# EAGLE design Walkie-Textie (EAGLE 7.6.0)
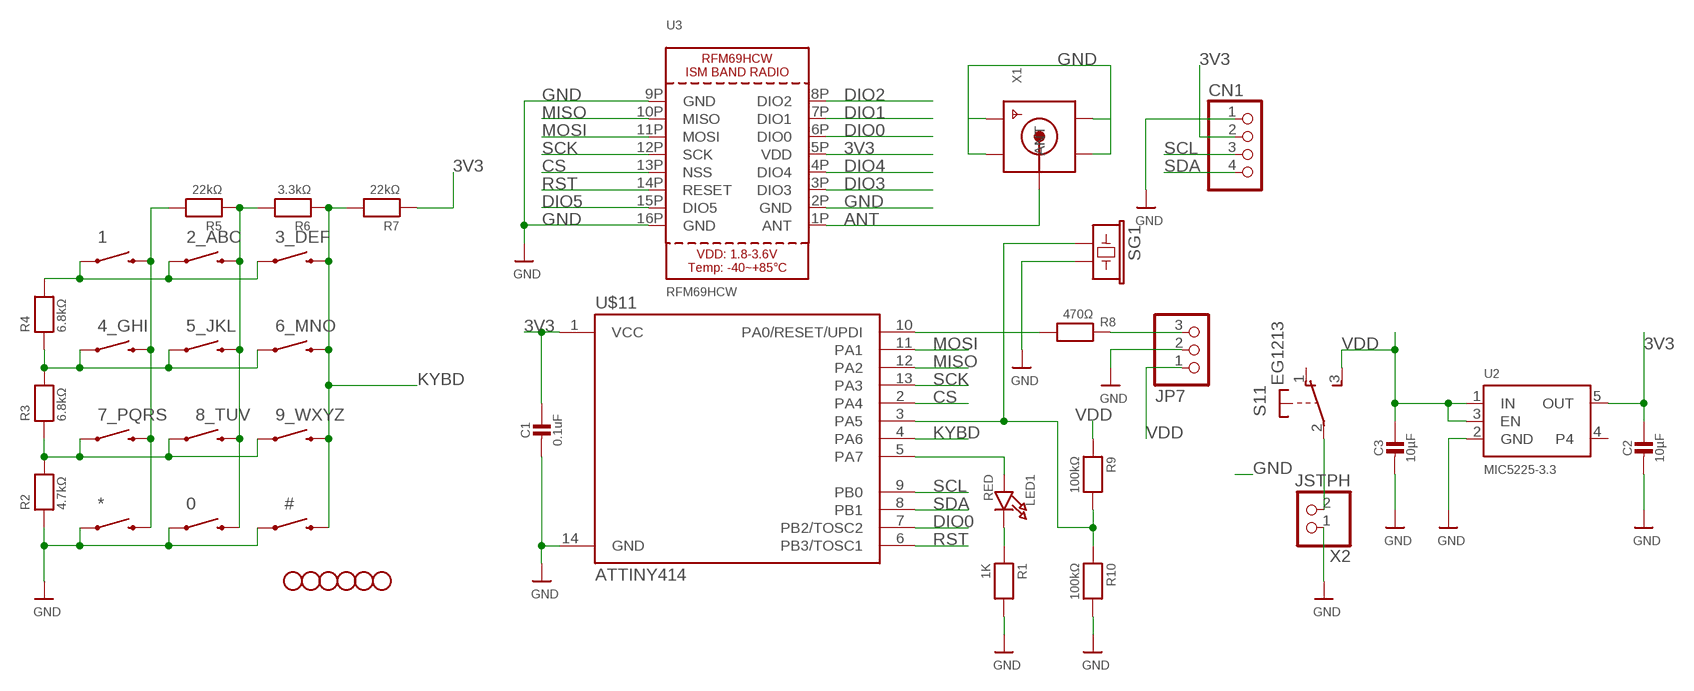
[diagram p0: schematic, sheet 1]

## Parts
0  SWITCH-MOMENTARY-2SMD-4  [TACTILE_SWITCH_TALL]
1  SWITCH-MOMENTARY-2SMD-4  [TACTILE_SWITCH_TALL]
2_ABC  SWITCH-MOMENTARY-2SMD-4  [TACTILE_SWITCH_TALL]
3_DEF  SWITCH-MOMENTARY-2SMD-4  [TACTILE_SWITCH_TALL]
4_GHI  SWITCH-MOMENTARY-2SMD-4  [TACTILE_SWITCH_TALL]
5_JKL  SWITCH-MOMENTARY-2SMD-4  [TACTILE_SWITCH_TALL]
6_MNO  SWITCH-MOMENTARY-2SMD-4  [TACTILE_SWITCH_TALL]
7_PQRS  SWITCH-MOMENTARY-2SMD-4  [TACTILE_SWITCH_TALL]
8_TUV  SWITCH-MOMENTARY-2SMD-4  [TACTILE_SWITCH_TALL]
9_WXYZ  SWITCH-MOMENTARY-2SMD-4  [TACTILE_SWITCH_TALL]
#  SWITCH-MOMENTARY-2SMD-4  [TACTILE_SWITCH_TALL]
*  SWITCH-MOMENTARY-2SMD-4  [TACTILE_SWITCH_TALL]
C1  0.1uF  CAP_CERAMIC0805-NOOUTLINE  [0805-NO]
C2  10µF  CAP_CERAMIC0805-NOOUTLINE  [0805-NO]
C3  10µF  CAP_CERAMIC0805-NOOUTLINE  [0805-NO]
CN1  HEADER-1X4ROUND  [1X04_ROUND]
JP1  STAND-OFF  [STAND-OFF]
JP2  STAND-OFF  [STAND-OFF]
JP3  STAND-OFF  [STAND-OFF]
JP4  STAND-OFF  [STAND-OFF]
JP5  STAND-OFF  [STAND-OFF]
JP6  STAND-OFF  [STAND-OFF]
JP7  PINHD-1X3CB  [1X03-CLEANBIG]
LED1  RED  LED0805_NOOUTLINE  [CHIPLED_0805_NOOUTLINE]
R1  1K  RESISTOR_0805MP  [_0805MP]
R2  4.7kΩ  RESISTOR_0805MP  [_0805MP]
R3  6.8kΩ  RESISTOR_0805MP  [_0805MP]
R4  6.8kΩ  RESISTOR_0805MP  [_0805MP]
R5  22kΩ  RESISTOR_0805MP  [_0805MP]
R6  3.3kΩ  RESISTOR_0805MP  [_0805MP]
R7  22kΩ  RESISTOR_0805MP  [_0805MP]
R8  470Ω  RESISTOR_0805MP  [_0805MP]
R9  100kΩ  RESISTOR_0805MP  [_0805MP]
R10  100kΩ  RESISTOR_0805MP  [_0805MP]
S1  EG1213  [EG1213]
SG1  BUZZERSMD3  [BUZZER-CMT1102]
U2  MIC5225-3.3  VREG_SOT23-5  [SOT23-5]
U3  RFM69HCW  RFM69HCW_SMT  [RFMHCW_SMT]
U$11  ATTINY414  [SO14]
X1  SMACONNECTOR_EDGE  [SMA_EDGELAUNCH]
X2  JSTPH  CON_JST_PH_2PIN  [JSTPH2]

## Nets
3V3 [power]: C1.1 C2.1 CN1.2 R7.1 U2.5(OUT) U3.5P(VDD) U$11.1(VCC)
ANT: U3.1P(ANT) X1.P(ANT)
CS: U3.13P(NSS) U$11.2(PA4)
DIO0: U3.6P(DIO0) U$11.7(PB2/TOSC2)
DIO1: U3.7P(DIO1)
DIO2: U3.8P(DIO2)
DIO3: U3.3P(DIO3)
DIO4: U3.4P(DIO4)
DIO5: U3.15P(DIO5)
GND: 0.A2 #.A2 *.A2 C1.2 C2.2 C3.2 CN1.1 JP7.2 R1.2 R2.1 R10.2 SG1.2 U2.2(GND) U3.2P(GND) U3.9P(GND) U3.16P(GND) U$11.14(GND) X1.GND@1(GND4) X1.GND@2(GND3) X1.GND@3(GND2) X1.GND@4(GND1) X2.1
GND1: 1.A2 2_ABC.A2 3_DEF.A2 R4.2
KYBD: 3_DEF.B2 6_MNO.B2 9_WXYZ.B2 #.B2 R6.1 R7.2 U$11.4(PA6)
MISO: U3.10P(MISO) U$11.12(PA2)
MOSI: U3.11P(MOSI) U$11.11(PA1)
N$1: R8.2 U$11.10(PA0/RESET/UPDI)
N$2: LED1.A U$11.5(PA7)
N$3: JP7.3 R8.1
N$6: 4_GHI.A2 5_JKL.A2 6_MNO.A2 R3.2 R4.1
N$7: 7_PQRS.A2 8_TUV.A2 9_WXYZ.A2 R2.2 R3.1
N$9: R9.2 R10.1 SG1.1 U$11.3(PA5)
N$11: 1.B2 4_GHI.B2 7_PQRS.B2 *.B2 R5.2
N$12: 0.B2 2_ABC.B2 5_JKL.B2 8_TUV.B2 R5.1 R6.2
N$16: LED1.C R1.1
N$17: S1.2(1:P) X2.2
RST: U3.14P(RESET) U$11.6(PB3/TOSC1)
SCK: U3.12P(SCK) U$11.13(PA3)
SCL: CN1.3 U$11.9(PB0)
SDA: CN1.4 U$11.8(PB1)
VDD: C3.1 JP7.1 R9.1 S1.3(1:S) U2.1(IN) U2.3(EN)
Unconnected: S1.1(1:O) S1.MT1(MT) S1.MT2(MT) U2.4

## Library data of the parts
0 1 2_ABC 3_DEF 4_GHI 5_JKL 6_MNO 7_PQRS 8_TUV 9_WXYZ # * = SparkFun-Electromechanical:SWITCH-MOMENTARY-2: Various NO switches- pushbuttons, reed, etc; PROD_ID: SWCH-11966
C1-C3 = microbuilder:CAP_CERAMIC: Ceramic Capacitors For new designs, use the packages preceded by an '_' character since they are more reliable: The following footprints should be used on most boards: _0402 - Standard footprint for regular board layouts _0603 - Standard footprint for regular board layouts _0805 - Standard footprint for regular board layouts _1206 - Standard footprint for regular board layouts For extremely tight-pitch boards where space is at a premium, the following 'micro-pitch' footprints can be used (smaller pads, no silkscreen outline, etc.): _0402MP - Micro-pitch footprint for very dense/compact boards _0603MP - Micro-pitch footprint for very dense/compact boards _0805MP - Micro-pitch footprint for very dense/compact boards _1206MP - Micro-pitch footprint for very dense/compact boards
CN1 = technoblogy:HEADER-1X4: PIN HEADER
JP1-JP6 = SparkFun:STAND-OFF: Stand Off This is the mechanical footprint for a #4 phillips button head screw. Use the keepout ring to avoid running the screw head into surrounding components. SKU : PRT-00447
JP7 = adafruit:PINHD-1X3: PIN HEADER
LED1 = microbuilder:LED: LED 0603 - 0603 Surface Mount Package 2mA: Green LED - Low Power (3.9mcd, 2ma, 1.7Vf) - Digikey: 475-2709-2-ND Orange LED - Low Power (9.8mcd, 2ma, 1.8Vf) - Digikey: 475-1194-2-ND Red LED - Low Power (5mcd, 2ma, 1.8Vf) - Digikey: 475-1195-2-ND Yellow LED - Low Power (7mcd, 2ma, 1.8Vf) - Digikey: 475-1196-2-ND 5mA: Blue LED - Low Power (17mcd, 5ma, 2.9Vf) - Digikey: LNJ937W8CRACT-ND 0805 - 0805 Surface Mount Package 2mA: Red LED (8.8mcd, 2mA, 1.8Vf, Clear) - Low Power [Digikey: 475-2510-1-ND] Green LED (5mcd, 2mA, 1.8Vf, Clear) - Low Power [Digikey: 475-2730-1-ND] Yellow LED (11.3mcd, 2mA, 1.8Vf, Clear) - Low Power [Digikey: 475-2555-1-ND] 20mA: Red LED (104mcd, 20mA, Diffused) - LS R976 [Digikey: 475-1278-6-ND] Red LED (12mcd, 20mA, 2.0Vf, Clear) - APT2012EC [Digikey: 754-1128-1-ND] Green LED (15mcd, 20mA, 2.2Vf, Clear) - APT2012GC [Digikey: 754-1131-1-ND] Orange LED (160mcd, 20mA, 2.1Vf, Clear) - APT2012SECK [Digikey: 754-1130-1-ND] 1206 - 1206 Surface Mount Package Green LED (26mcd, 20mA, Diffused) - LG N971 [Digikey: 475-1407-6-ND] Red LED (15mcd, 20mA, Diffused) - LH N974 [Digikey: 475-1416-6-ND]
R1-R10 = microbuilder:RESISTOR: Resistors 0402 - 0402 Surface Mount Package 22 Ohm 1% 1/16W [Digikey: 311-22.0LRTR-ND] 33 Ohm 5% 1/16W 1.0K 5% 1/16W 1.5K 5% 1/16W 2.0K 1% 1/16W 10.0K 1% 1/16W [Digikey: 311-10.0KLRTR-ND] 10.0K 5% 1/16W [Digikey: RMCF0402JT10K0TR-ND] 12.1K 1% 1/16W [Digikey: 311-22.0LRTR-ND] 100.0K 5% 1/16W 0603 - 0603 Surface Mount Package 0 Ohm 1/10 Watt 1% Resistor 15 Ohm 1/10 Watt 1% Resistor 33 Ohm 1/10 Watt 1% Resistor 49.9 Ohm 1/10 Watt 1% Resistor 100 Ohm 1/10 Watt 1% Resistor 150 Ohm 1/10 Watt 1% Resistor 240 Ohm 1/10 Watt 1% Resistor 390 Ohm 1/10 Watt 1% Resistor 560 Ohm 1/10 Watt 1% Resistor 680 Ohm 1/10 Watt 1% Resistor 750 Ohm 1/10 Watt 1% Resistor 1.0K Ohm 1/10 Watt 1% Resistor 1.5K Ohm 1/10 Watt 1% Resistor 2.0K Ohm 1/10 Watt 1% Resistor 2.2K Ohm 1/10 Watt 1% Resistor 3.3K Ohm 1/10 Watt 1% Resistor 4.7K Ohm 1/10 Watt 1% Resistor 10.0K Ohm 1/10 Watt 1% Resistor 12.0K Ohm 1/10 Watt 1% Resistor 12.1K Ohm 1/10 Watt 1% Resistor 20.0K Ohm 1/10 Watt 1% Resistor 33.0K Ohm 1/10 Watt 1% Resistor 100.0K Ohm 1/10 Watt 1% Resistor 0805 - 0805 Surface Mount Package 0 Ohm 1/8 Watt 1% Resistor 33 Ohm 1/8 Watt 1% Resistor 100 Ohm 1/8 Watt 1% Resistor 150 Ohm 1/8 Watt 1% Resistor 200 Ohm 1/8 Watt 1% Resistor 240 Ohm 1/8 Watt 1% Resistor 330 Ohm 1/8 Watt 1% Resistor 390 Ohm 1/8 Watt 1% Resistor 470 Ohm 1/8 Watt 1% Resistor 1.0K Ohm 1/8 Watt 1% Resistor 1.5K Ohm 1/8 Watt 1% Resistor 2.0K Ohm 1/8 Watt 1% Resistor 4.7K Ohm 1/8 Watt 1% Resistor 5.1K Ohm 1/8 Watt 1% Resistor 5.6K Ohm 1/8 Watt 1% Resistor 10.0K Ohm 1/8 Watt 1% Resistor 22.0K Ohm 1/8 Watt 1% Resistor 33.0K Ohm 1/8 Watt 1% Resistor 100K Ohm 1/8 Watt 1% Resistor 1206 - 1206 Surface Mount Package 2012 - 2010 Surface Mount Package 0.11 Ohm 1/2 Watt 1% Resistor - Digikey: RHM.11UCT-ND
S1 = adafruit:EG1213: E-Switch right-angle slide SPDT Part #EG1213 http://www.ladyada.net/library/eagle
SG1 = SparkFun-Electromechanical:BUZZER: Buzzer 12mm Spark Fun Electronics SKU : Comp-Buzzer
U2 = microbuilder:VREG_SOT23-5: SOT23-5 Fixed Voltage Regulators Part Current Out V Out V In V Dropout θJA (°C/W) TJ (°C) Digikey Part No. ADP121 150mA 3.3V 3.4-5.5V 0.09V @ 150mA -- -- ADP121-AUJZ33R7CT-ND ADP121 150mA 3.0V 3.1-5.5V 0.09V @ 150mA -- -- ADP121-AUJZ30R7CT-ND ADP122 300mA 3.3V 3.4-5.5V 0.085V @ 300mA -- -- ADP122AUJZ-3.3-R7CT-ND ADP1712 300mA 3.3V 3.5-5.5V 0.17V @ 300mA -- -- ADP1712AUJZ-3.3-R7TR-ND AP7311 (Low Cost) 150mA 3.3V 3.5-6V 0.15V @ 150mA -- -- AP7311-33WG-7DICT-ND LD39015M18R 150mA 1.8V 1.9V-5.5V 0.08V @ 100mA -- -- 497-6977-1-ND LP2985A-33DBVR 150mA 3.3V 3.3-16V 0.28V @ 150mA 206 150 296-18479-1-ND MCP1824T-3302E/OT 300mA 3.3V 3.5V-6V 0.2V @ 300mA -- -- MCP1824T-3302E/OTCT-ND MIC5205-2.5YM5 TR 150mA 2.5V 2.7-16V 0.165V @ 150mA -- -- 576-1257-2-ND MIC5205-3.0YM5 TR 150mA 3.0V 3.2V-16V 0.165V @ 150mA -- -- 576-1258-2-ND MIC5205-3.3YM5 TR 150mA 3.3V 3.5V-16V 0.165V @ 150mA -- -- 576-1259-2-ND TPS780330220 150mA 3.3V+2.2V 3.6-5.5V 250mV Max -- -- 296-23332-1-ND TDA3663/N1,135 100mA 3.3V 3.5-45V 0.18V @ 50mA -- -- 568-5343-1-ND Max operating temp can be calculated using θJA, TJ (max junction temperature), and power in watts. Set the "Maximum Ambient Temperature" until it reaches TJ ("Max Junction Temperature"), which is the absolute limit for safe use of the regulator: Heat Sink Temperature Calculator <http://www.daycounter.com/Calculators/Heat-Sink-Temperature-Calculator.phtml> For example, With 12V source into a 3.3V LP2985 and a 30mA load, we are dissipating (12V-3.3V) * 0.03A = 0.261W. With a θJA of 206 °C/W, a TJ of 150°C, and 261mW we can safely use the chip without a heat sink up to 75°C (=147.1°C Junction Temperature).
U3 = microbuilder:RFM69HCW: RFM69HCW - ISM Band RF Transceiver
U$11 = technoblogy:ATTINY414: Atmel 14-pin 2/4/8kB flash uC; PROD_ID: IC-11285
X1 = adafruit:SMACONNECTOR: SMA Connector 90° DIP SMA Connector, 50 Ohm (4UConnector: 07259)
X2 = microbuilder:CON_JST_PH_2PIN: JST 2-Pin Right-Angle Connector PH-Series - 4UConnector: 17311 SH-Series - 4UConnector: 07278

## Net classes
1 power: width 0.254 mm

## Board
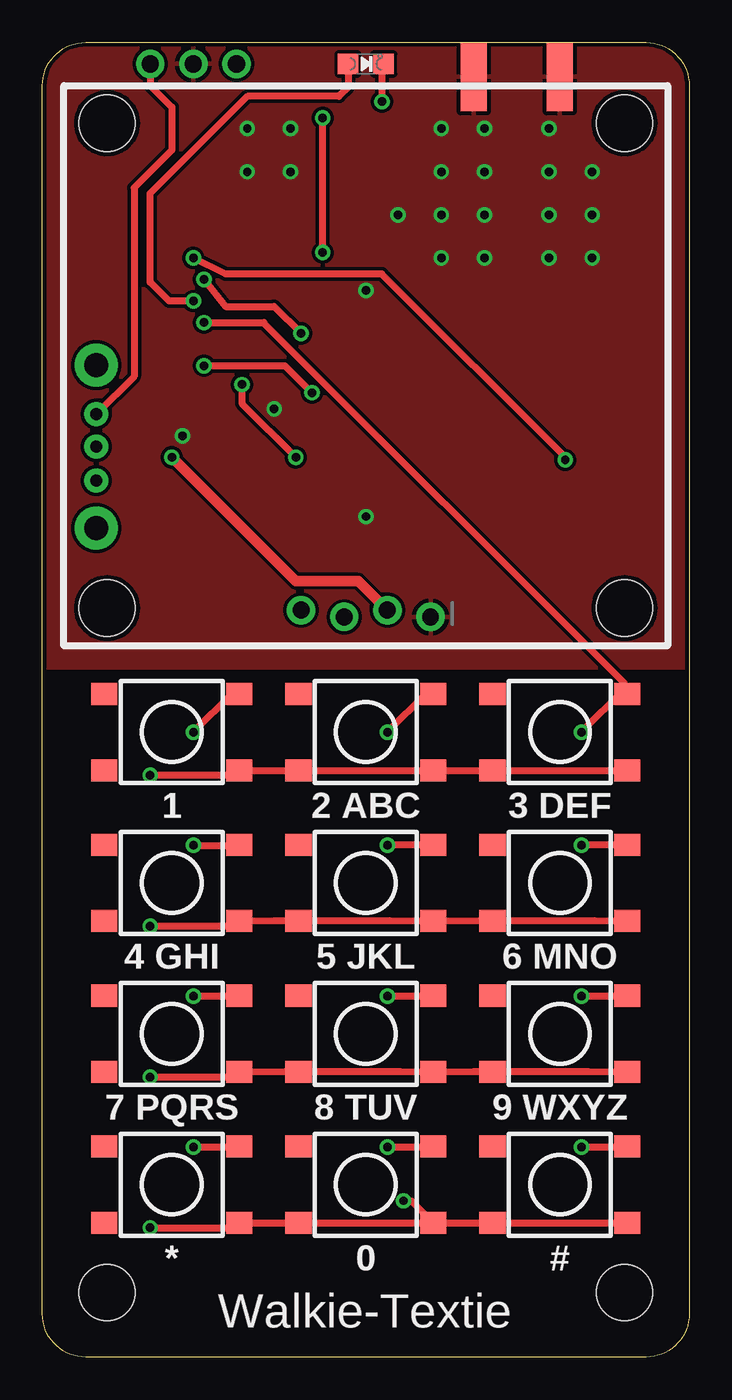
[diagram p1: board, top side]
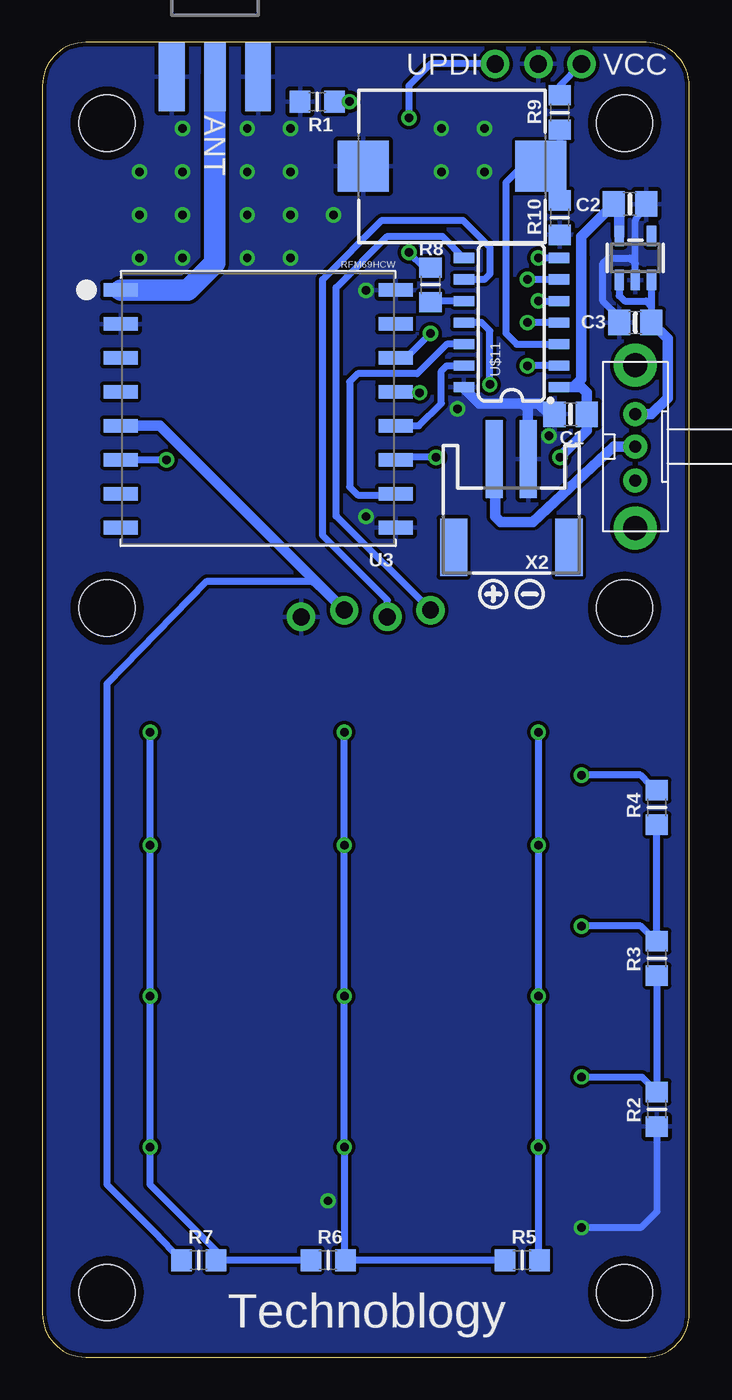
[diagram p2: board, bottom side, seen from below]

Size 38.1 x 77.47 mm. Coordinates in mm from the lower left corner, seen from the top.
Outline: 0,74.93 arc-90 2.54,77.47 35.56,77.47 arc-90 38.1,74.93 38.1,2.54 arc-90 35.56,0 2.54,0 arc-90 0,2.54 0,74.93
Copper layers (1*16): Top 0.035mm / dielectric 1.5mm / Bottom 0.035mm
Design rules "adafruit *": minimum track width 8mil, minimum drill 15.5mil, track to track 8mil, track to pad 8mil, pad to pad 8mil, via to via 8mil, smd to smd 8mil, copper to edge 10mil, drill to drill 8mil, minimum pad ring 10mil, minimum via ring 8mil, stop-mask expansion 2mil, vias tented up to drill 20mil, thermal gap 10mil

### Footprints (pad centres in the part's own frame; a part is rotated, then mirrored left to right if it is on the bottom)
TACTILE_SWITCH_TALL = smd 1.55 x 1.3: A1 -3.975,-2.25; A2 3.975,-2.25; B1 -3.975,2.25; B2 3.975,2.25
0805-NO = smd 1.3 x 1.5: 1 -0.95,0; 2 0.95,0
1X04_ROUND = drill 1 pad 1.676: 1 -3.81,0.203; 2 -1.27,-0.203; 3 1.27,0.203; 4 3.81,-0.203
STAND-OFF = hole 3.302: 0,0
1X03-CLEANBIG = drill 1.016 pad 1.676: 1 -2.54,0; 2 0,0; 3 2.54,0
CHIPLED_0805_NOOUTLINE = smd 1.2 x 1.2: A 0,-1.05; C 0,1.05
_0805MP = smd 1.2 x 1.3: 1 -1.016,0; 2 1.016,0
EG1213 = drill 0.7 pad 1.422: 1 -2,0; 2 0,0; 3 1.9,0 | drill 1.4 pad 2.54: MT1 -4.8,0; MT2 4.8,0
BUZZER-CMT1102 = smd 3 x 3: 1 -5.23,0; 2 5.23,0
SOT23-5 = smd 0.55 x 1.2: 1 -0.95,-1.3; 2 0,-1.3; 3 0.95,-1.3; 4 0.95,1.3; 5 -0.95,1.3
RFMHCW_SMT = smd 2 x 0.8: 1P 8.1,-7; 2P 8.1,-5; 3P 8.1,-3; 4P 8.1,-1; 5P 8.1,1; 6P 8.1,3; 7P 8.1,5; 8P 8.1,7; 9P -8.1,7; 10P -8.1,5; 11P -8.1,3; 12P -8.1,1; 13P -8.1,-1; 14P -8.1,-3; 15P -8.1,-5; 16P -8.1,-7
SO14 = smd 0.6 x 1.2: 1 -3.81,-2.8; 2 -2.54,-2.8; 3 -1.27,-2.8; 4 0,-2.8; 5 1.27,-2.8; 6 2.54,-2.8; 7 3.81,-2.8; 8 3.81,2.8; 9 2.54,2.8; 10 1.27,2.8; 11 0,2.8; 12 -1.27,2.8; 13 -2.54,2.8; 14 -3.81,2.8
SMA_EDGELAUNCH = smd 4.064 x 1.524: GND@1 2.032,-2.54; GND@2 2.032,2.54 | smd 4.064 x 1.524 bottom: GND@3 2.032,2.54; GND@4 2.032,-2.54 | smd 4.064 x 1.27: P 2.032,0
JSTPH2 = smd 1 x 4.6: 1 -1,-3.7; 2 1,-3.7 | smd 1.6 x 3.4: NC1 -3.4,1.5; NC2 3.4,1.5

### Placement (x,y rotation side)
0  19.05,10.16 0 top
1  7.62,36.83 0 top
2_ABC  19.05,36.83 0 top
3_DEF  30.48,36.83 0 top
4_GHI  7.62,27.94 0 top
5_JKL  19.05,27.94 0 top
6_MNO  30.48,27.94 0 top
7_PQRS  7.62,19.05 0 top
8_TUV  19.05,19.05 0 top
9_WXYZ  30.48,19.05 0 top
#  30.48,10.16 0 top
*  7.62,10.16 0 top
C1  6.98,55.56 180 bottom
C2  3.49,67.95 0 bottom
C3  3.17,60.96 180 bottom
CN1  19.05,43.82 180 top
JP1  3.81,72.71 0 top
JP2  34.29,72.71 0 top
JP3  3.81,3.81 0 top
JP4  34.29,44.13 0 top
JP5  3.81,44.13 0 top
JP6  34.29,3.81 0 top
JP7  8.89,76.2 0 top
LED1  19.05,76.2 270 top
R1  21.91,73.98 180 bottom
R2  1.91,14.61 90 bottom
R3  1.91,23.49 90 bottom
R4  1.91,32.38 90 bottom
R5  9.84,5.71 0 bottom
R6  21.27,5.71 0 bottom
R7  28.89,5.71 0 bottom
R8  15.24,63.18 270 bottom
R9  7.62,73.34 270 bottom
R10  7.62,67.15 270 bottom
S1  3.17,53.66 90 bottom
SG1  13.97,70.17 180 bottom
U2  3.17,64.77 0 bottom
U3  25.4,55.88 180 bottom
U$7  [SYMBOL_PLUS]  11.56,44.96 0 bottom
U$11  10.48,60.96 90 bottom
U$14  [SYMBOL_MINUS]  9.4,44.96 0 bottom
X1  27.94,77.47 270 bottom
X2  10.48,49.21 180 bottom

### Tracks (layer width: path | path; a pad name or v marks a point on that pad's centre or on a via)
3V3  (via drill 0.5)
  Top 0.61: CN1.2 18.62,45.72 14.92,45.72 v7.62,53.02
  Bottom 0.406: 4.12,67.63 C2.1 | R7.1 31.5,7.37 34.29,10.16 34.29,39.69 28.42,45.72 22.22,45.72 CN1.2 | U3.5P 34.02,54.88
  Bottom 0.61: U2.5 4.12,67.63 | C2.1 6.35,66.04 6.35,64.77 6.35,57.63 6.83,57.15 U$11.1 6.35,57.15 6.03,56.83 C1.1 | CN1.2 31.18,54.88 U3.5P | C1.1 | C1.1 6.03,54.61 v7.62,53.02
ANT
  Bottom 0.406: 33.49,62.87 U3.1P
  Bottom 1.27: X1.P 27.94,64.45 29.53,62.87 33.49,62.87
CS  (via drill 0.5)
  Top 0.406: v9.53,58.42 14.29,58.42 v15.88,56.83
  Bottom 0.406: U$11.2 v9.53,58.42 | v15.88,56.83 17.25,56.83 U3.13P
DIO0  (via drill 0.5)
  Top 0.406: v8.89,64.77 10.79,63.82 20,63.82 30.8,53.02 v30.8,52.86
  Bottom 0.406: U$11.7 v8.89,64.77 | U3.6P 30.81,52.88 v30.8,52.86
GND  (via drill 0.5)
  Top 0.406: 11.57,7.94 *.A2 | v21.27,9.21 21.73,9.21 0.A2 | *.A2 0.A2 | 0.A2 #.A2 | v6.35,7.62 11.3,7.62 *.A2
  Bottom 0.406: C3.2 4.12,61.28 4.13,61.28 5.08,62.23 5.08,64.45 4.76,64.77 3.49,64.77 3.17,64.45 | U2.2 3.17,64.45 | 3.17,64.45 3.17,67 C2.2 | v6.35,7.62 2.86,7.62 1.91,8.57 R2.1
  Bottom 0.61: 13.33,57.15 12.38,56.2 9.84,56.2 | 9.84,56.2 9.53,55.88 9.53,54.29 | 9.84,56.2 8.89,56.2 8.26,55.56
  other vias: 26.04,72.39 23.5,72.39 20.95,67.31 29.84,72.39 29.84,69.85 32.38,69.85 26.04,69.85 23.5,69.85 26.04,67.31 23.5,67.31 32.38,64.77 23.5,64.77 29.84,64.77 29.84,67.31 32.38,67.31 26.04,64.77 13.65,55.88 8.26,54.29 19.05,49.53 19.05,62.87 14.61,72.39 14.61,69.85 12.06,69.85 12.06,72.39
  pour Bottom (isolate 0.203): 0,0 0,77.42 38.1,77.42 38.1,0
  pour Top: 0,77.47 38.1,77.47 38.1,40.64 0,40.64
GND1  (via drill 0.5)
  Top 0.406: 3_DEF.A2 2_ABC.A2 1.A2 11.59,34.29 v6.35,34.29
  Bottom 0.406: R4.2 2.29,33.72 2.86,34.29 v6.35,34.29
KYBD  (via drill 0.5)
  Top 0.406: 34.46,12.54 #.B2 34.43,12.38 v31.75,12.38 | v31.75,36.83 34.29,39.37 | 34.29,39.37 34.29,39.25 3_DEF.B2 | 34,21.3 9_WXYZ.B2 34.43,21.27 v31.75,21.27 | v9.53,60.96 13.05,60.96 13.05,60.93 34.29,39.69 34.29,39.37 | 6_MNO.B2 31.78,30.19 v31.75,30.16
  Bottom 0.406: U$11.4 v9.53,60.96 | R6.1 R7.2 27.88,6.29 31.75,10.16 v31.75,12.38 v31.75,21.27 v31.75,30.16 v31.75,36.83
MISO
  Bottom 0.406: U$11.12 14.29,59.69 16.03,57.94 19.53,57.94 20,57.47 20,51.28 19.53,50.8 17.38,50.8 U3.10P
MOSI  (via drill 0.5)
  Top 0.406: v11.75,57.31 11.75,56.2 v14.92,53.02
  Bottom 0.406: v11.75,57.31 11.75,60.48 12.22,60.96 U$11.11 | v14.92,53.02 17.16,53.02 U3.11P
N$1
  Bottom 0.406: U$11.10 14.54,62.23 R8.2
N$2  (via drill 0.5)
  Top 0.406: v8.89,62.23 7.46,62.23 6.35,63.34 6.35,68.58 12.06,74.3 17.46,74.3 18,74.83 LED1.A
  Bottom 0.406: v8.89,62.23 U$11.5
N$3  (via drill 0.5)
  Top 0.406: v16.51,65.09 v16.51,73.03
  Bottom 0.406: 15.24,64.45 R8.1 15.62,64.2 v16.51,65.09 | JP7.3 15.24,76.2 16.51,74.93 v16.51,73.03
N$6  (via drill 0.5)
  Top 0.406: 6_MNO.A2 32.52,25.72 25.72,25.72 23.15,25.69 5_JKL.A2 20.46,25.72 13.65,25.72 11.72,25.69 4_GHI.A2 11.3,25.4 v6.35,25.4
  Bottom 0.406: R4.1 R3.2 1.97,24.51 2.86,25.4 v6.35,25.4
N$7  (via drill 0.5)
  Top 0.406: 9_WXYZ.A2 32.2,16.83 25.4,16.83 23.15,16.8 8_TUV.A2 21.09,16.83 14.29,16.83 11.72,16.8 7_PQRS.A2 11.3,16.51 v6.35,16.51
  Bottom 0.406: R3.1 R2.2 2.79,16.51 v6.35,16.51
N$9
  Bottom 0.406: U$11.3 10.16,59.69 10.79,60.33 10.79,69.22 10.16,69.85 9.38,69.85 SG1.1 | R9.2 7.62,71.29 SG1.1 | R10.1 7.62,69.05 SG1.1
N$11  (via drill 0.5)
  Top 0.406: 11.59,12.54 *.B2 11.57,12.38 v8.89,12.38 | 1.B2 11.14,39.08 v8.89,36.83 | 11.26,21.42 11.59,21.42 7_PQRS.B2 11.57,21.27 v8.89,21.27 | 11.26,30.31 11.59,30.31 4_GHI.B2 11.57,30.16 v8.89,30.16
  Bottom 0.406: v8.89,36.83 v8.89,30.16 v8.89,21.27 v8.89,12.38 8.89,5.78 R5.2
N$12  (via drill 0.5)
  Top 0.406: 23.02,12.54 0.B2 23,12.38 v20.32,12.38 | 2_ABC.B2 22.57,39.08 v20.32,36.83 | v20.32,21.27 23,21.27 8_TUV.B2 | 5_JKL.B2 20.35,30.19 v20.32,30.16
  Bottom 0.406: v20.32,36.83 v20.32,30.16 v20.32,21.27 v20.32,12.38 20.32,5.78 R6.2 R5.1
N$16  (via drill 0.5)
  Top 0.406: LED1.C 20,76.2 v20,73.98
  Bottom 0.406: v20,73.98 R1.1
N$17
  Bottom 0.61: S1.2 4.45,53.66 9.21,49.21 11.11,49.21 11.43,49.53 11.43,54.61 11.48,54.56 X2.2
RST  (via drill 0.5)
  Top 0.406: v9.53,63.5 10.79,61.91 13.65,61.91 v15.24,60.33
  Bottom 0.406: 7.62,63.5 U$11.6 v9.53,63.5 | v15.24,60.33 16.83,58.74 17.16,58.74 U3.14P
SCK
  Bottom 0.406: U3.12P 15.92,54.88 14.61,56.2 14.61,58.1 14.29,58.42 U$11.13
SCL
  Bottom 0.406: CN1.3 17.78,44.61 21.59,48.42 21.59,63.5 18.1,66.99 13.33,66.99 11.75,65.41 11.75,63.82 12.06,63.5 U$11.9
SDA
  Bottom 0.406: CN1.4 20.75,49.53 20.8,49.53 20.8,63.02 17.78,66.04 14.55,66.04 U$11.8
VDD
  Top 0.406: JP7.1 6.35,74.93 7.62,73.66 7.62,71.12 5.4,68.9 5.4,57.78 S1.3
  Bottom 0.406: U2.3 2.23,61.91 | 2.23,61.91 C3.1 | U2.1 4.12,62.55 3.81,62.23 2.54,62.23 2.23,61.91 | R9.1 7.62,74.93 JP7.1
  Bottom 0.61: S1.3 2.23,55.56 1.27,56.52 1.27,60.01 C3.1

### Text on the board
tPlace: 2 ABC | 3 DEF | 4 GHI | 5 JKL | 6 MNO | 7 PQRS | 8 TUV | 9 WXYZ | Walkie-Textie
bPlace: VCC | UPDI | ANT | Technoblogy